# EAGLE design PGTN015_attenuverting_mixer (EAGLE 8.5.2)
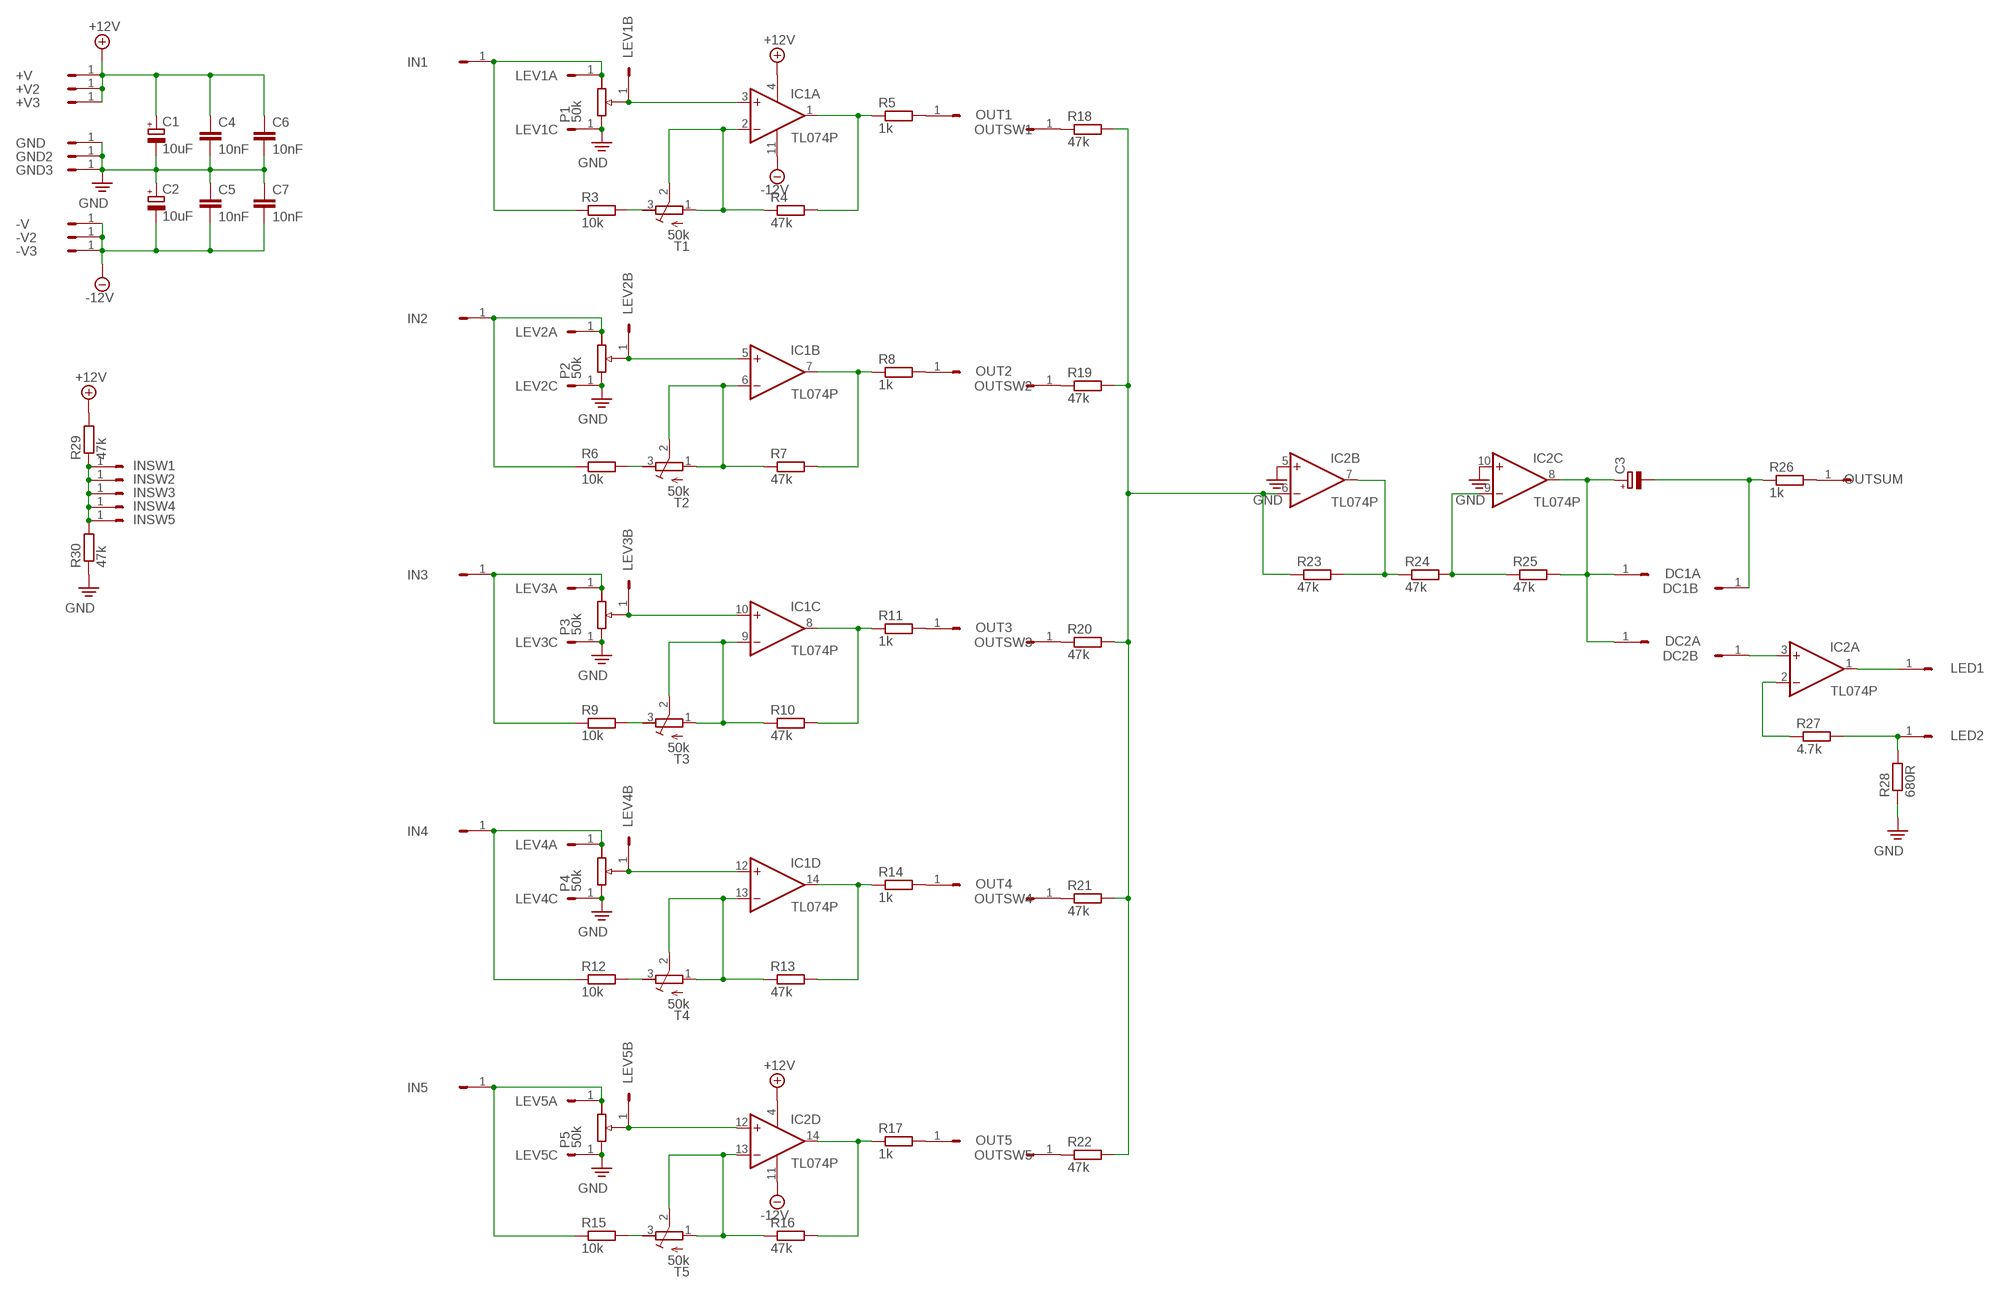
[diagram p0: schematic, sheet 1]

## Parts
+V  HEADER/MALE/01  [HEADER/MALE/01]
+V2  HEADER/MALE/01  [HEADER/MALE/01]
+V3  HEADER/MALE/01  [HEADER/MALE/01]
-V  HEADER/MALE/01  [HEADER/MALE/01]
-V2  HEADER/MALE/01  [HEADER/MALE/01]
-V3  HEADER/MALE/01  [HEADER/MALE/01]
C1  10uF  CAPACITOR/POLARIZEDE2.5-6  [E2,5-6]
C2  10uF  CAPACITOR/POLARIZEDE2.5-6  [E2,5-6]
C3  CAPACITOR/POLARIZEDE2.5-6  [E2,5-6]
C4  10nF  CAPACITORCERAMICDISC/5  [CERAMICDISC/5]
C5  10nF  CAPACITORCERAMICDISC/5  [CERAMICDISC/5]
C6  10nF  CAPACITORCERAMICDISC/5  [CERAMICDISC/5]
C7  10nF  CAPACITORCERAMICDISC/5  [CERAMICDISC/5]
DC1A  HEADER/MALE/01  [HEADER/MALE/01]
DC1B  HEADER/MALE/01  [HEADER/MALE/01]
DC2A  HEADER/MALE/01  [HEADER/MALE/01]
DC2B  HEADER/MALE/01  [HEADER/MALE/01]
GND  HEADER/MALE/01  [HEADER/MALE/01]
GND2  HEADER/MALE/01  [HEADER/MALE/01]
GND3  HEADER/MALE/01  [HEADER/MALE/01]
IC1  TL074P  [DIL14]
IC2  TL074P  [DIL14]
IN1  HEADER/MALE/01  [HEADER/MALE/01]
IN2  HEADER/MALE/01  [HEADER/MALE/01]
IN3  HEADER/MALE/01  [HEADER/MALE/01]
IN4  HEADER/MALE/01  [HEADER/MALE/01]
IN5  HEADER/MALE/01  [HEADER/MALE/01]
INSW1  HEADER/MALE/01  [HEADER/MALE/01]
INSW2  HEADER/MALE/01  [HEADER/MALE/01]
INSW3  HEADER/MALE/01  [HEADER/MALE/01]
INSW4  HEADER/MALE/01  [HEADER/MALE/01]
INSW5  HEADER/MALE/01  [HEADER/MALE/01]
LED1  HEADER/MALE/01  [HEADER/MALE/01]
LED2  HEADER/MALE/01  [HEADER/MALE/01]
LEV1A  HEADER/MALE/01  [HEADER/MALE/01]
LEV1B  HEADER/MALE/01  [HEADER/MALE/01]
LEV1C  HEADER/MALE/01  [HEADER/MALE/01]
LEV2A  HEADER/MALE/01  [HEADER/MALE/01]
LEV2B  HEADER/MALE/01  [HEADER/MALE/01]
LEV2C  HEADER/MALE/01  [HEADER/MALE/01]
LEV3A  HEADER/MALE/01  [HEADER/MALE/01]
LEV3B  HEADER/MALE/01  [HEADER/MALE/01]
LEV3C  HEADER/MALE/01  [HEADER/MALE/01]
LEV4A  HEADER/MALE/01  [HEADER/MALE/01]
LEV4B  HEADER/MALE/01  [HEADER/MALE/01]
LEV4C  HEADER/MALE/01  [HEADER/MALE/01]
LEV5A  HEADER/MALE/01  [HEADER/MALE/01]
LEV5B  HEADER/MALE/01  [HEADER/MALE/01]
LEV5C  HEADER/MALE/01  [HEADER/MALE/01]
OUT1  HEADER/MALE/01  [HEADER/MALE/01]
OUT2  HEADER/MALE/01  [HEADER/MALE/01]
OUT3  HEADER/MALE/01  [HEADER/MALE/01]
OUT4  HEADER/MALE/01  [HEADER/MALE/01]
OUT5  HEADER/MALE/01  [HEADER/MALE/01]
OUTSUM  HEADER/MALE/01  [HEADER/MALE/01]
OUTSW1  HEADER/MALE/01  [HEADER/MALE/01]
OUTSW2  HEADER/MALE/01  [HEADER/MALE/01]
OUTSW3  HEADER/MALE/01  [HEADER/MALE/01]
OUTSW4  HEADER/MALE/01  [HEADER/MALE/01]
OUTSW5  HEADER/MALE/01  [HEADER/MALE/01]
P1  50k  POTENTIOMETER  (no package)
P2  50k  POTENTIOMETER  (no package)
P3  50k  POTENTIOMETER  (no package)
P4  50k  POTENTIOMETER  (no package)
P5  50k  POTENTIOMETER  (no package)
R3  10k  RESISTORRESISTOR/UPRIGHT/7.5  [RESISTOR/7.5]
R4  47k  RESISTORRESISTOR/UPRIGHT/7.5  [RESISTOR/7.5]
R5  1k  RESISTORRESISTOR/UPRIGHT/7.5  [RESISTOR/7.5]
R6  10k  RESISTORRESISTOR/UPRIGHT/7.5  [RESISTOR/7.5]
R7  47k  RESISTORRESISTOR/UPRIGHT/7.5  [RESISTOR/7.5]
R8  1k  RESISTORRESISTOR/UPRIGHT/7.5  [RESISTOR/7.5]
R9  10k  RESISTORRESISTOR/UPRIGHT/7.5  [RESISTOR/7.5]
R10  47k  RESISTORRESISTOR/UPRIGHT/7.5  [RESISTOR/7.5]
R11  1k  RESISTORRESISTOR/UPRIGHT/7.5  [RESISTOR/7.5]
R12  10k  RESISTORRESISTOR/UPRIGHT/7.5  [RESISTOR/7.5]
R13  47k  RESISTORRESISTOR/UPRIGHT/7.5  [RESISTOR/7.5]
R14  1k  RESISTORRESISTOR/UPRIGHT/7.5  [RESISTOR/7.5]
R15  10k  RESISTORRESISTOR/UPRIGHT/7.5  [RESISTOR/7.5]
R16  47k  RESISTORRESISTOR/UPRIGHT/7.5  [RESISTOR/7.5]
R17  1k  RESISTORRESISTOR/UPRIGHT/7.5  [RESISTOR/7.5]
R18  47k  RESISTORRESISTOR/UPRIGHT/7.5  [RESISTOR/7.5]
R19  47k  RESISTORRESISTOR/UPRIGHT/7.5  [RESISTOR/7.5]
R20  47k  RESISTORRESISTOR/UPRIGHT/7.5  [RESISTOR/7.5]
R21  47k  RESISTORRESISTOR/UPRIGHT/7.5  [RESISTOR/7.5]
R22  47k  RESISTORRESISTOR/UPRIGHT/7.5  [RESISTOR/7.5]
R23  47k  RESISTORRESISTOR/UPRIGHT/7.5  [RESISTOR/7.5]
R24  47k  RESISTORRESISTOR/UPRIGHT/7.5  [RESISTOR/7.5]
R25  47k  RESISTORRESISTOR/UPRIGHT/7.5  [RESISTOR/7.5]
R26  1k  RESISTORRESISTOR/UPRIGHT/7.5  [RESISTOR/7.5]
R27  4.7k  RESISTORRESISTOR/UPRIGHT/7.5  [RESISTOR/7.5]
R28  680R  RESISTORRESISTOR/UPRIGHT/7.5  [RESISTOR/7.5]
R29  47k  RESISTORRESISTOR/UPRIGHT/7.5  [RESISTOR/7.5]
R30  47k  RESISTORRESISTOR/UPRIGHT/7.5  [RESISTOR/7.5]
T1  50k  TRIMMER64X  [TRIMMER/64B]
T2  50k  TRIMMER64X  [TRIMMER/64B]
T3  50k  TRIMMER64X  [TRIMMER/64B]
T4  50k  TRIMMER64X  [TRIMMER/64B]
T5  50k  TRIMMER64X  [TRIMMER/64B]

## Nets
+12V: +V2.1 +V3.1 +V.1 C1.+ C4.1 C6.1 IC1.4(P:V+) IC2.4(P:V+) R29.2
-12V: -V2.1 -V3.1 -V.1 C2.- C5.2 C7.2 IC1.11(P:V-) IC2.11(P:V-)
GND: C1.- C2.+ C4.2 C5.1 C6.2 C7.1 GND2.1 GND3.1 GND.1 IC2.5(B:+IN) IC2.10(C:+IN) LEV1C.1 LEV2C.1 LEV3C.1 LEV4C.1 LEV5C.1 P1.E P2.E P3.E P4.E P5.E R28.1 R30.1
N$1: IC1.2(A:-IN) R4.1 T1.1(E) T1.2(S)
N$2: IC1.3(A:+IN) LEV1B.1 P1.S
N$3: R3.2 T1.3(A)
N$4: IC1.1(A:OUT) R4.2 R5.1
N$5: IN1.1 LEV1A.1 P1.A R3.1
N$6: OUT1.1 R5.2
N$7: IC1.6(B:-IN) R7.1 T2.1(E) T2.2(S)
N$8: R6.2 T2.3(A)
N$9: IC1.7(B:OUT) R7.2 R8.1
N$10: IC1.5(B:+IN) LEV2B.1 P2.S
N$11: IN2.1 LEV2A.1 P2.A R6.1
N$12: OUT2.1 R8.2
N$13: IC1.9(C:-IN) R10.1 T3.1(E) T3.2(S)
N$14: R9.2 T3.3(A)
N$15: IC1.8(C:OUT) R10.2 R11.1
N$16: IC1.10(C:+IN) LEV3B.1 P3.S
N$17: IN3.1 LEV3A.1 P3.A R9.1
N$18: OUT3.1 R11.2
N$19: IC1.13(D:-IN) R13.1 T4.1(E) T4.2(S)
N$20: R12.2 T4.3(A)
N$21: IC1.14(D:OUT) R13.2 R14.1
N$22: IC1.12(D:+IN) LEV4B.1 P4.S
N$23: IN4.1 LEV4A.1 P4.A R12.1
N$24: OUT4.1 R14.2
N$25: IC2.13(D:-IN) R16.1 T5.1(E) T5.2(S)
N$26: R15.2 T5.3(A)
N$27: IC2.14(D:OUT) R16.2 R17.1
N$28: IC2.12(D:+IN) LEV5B.1 P5.S
N$29: IN5.1 LEV5A.1 P5.A R15.1
N$30: OUT5.1 R17.2
N$31: OUTSW1.1 R18.1
N$32: OUTSW2.1 R19.1
N$33: OUTSW3.1 R20.1
N$34: OUTSW4.1 R21.1
N$35: OUTSW5.1 R22.1
N$36: C3.- DC1B.1 R26.1
N$37: IC2.7(B:OUT) R23.2 R24.1
N$38: IC2.6(B:-IN) R18.2 R19.2 R20.2 R21.2 R22.2 R23.1
N$39: IC2.9(C:-IN) R24.2 R25.1
N$40: C3.+ DC1A.1 DC2A.1 IC2.8(C:OUT) R25.2
N$41: OUTSUM.1 R26.2
N$42: DC2B.1 IC2.3(A:+IN)
N$43: IC2.2(A:-IN) R27.1
N$44: LED2.1 R27.2 R28.2
N$45: IC2.1(A:OUT) LED1.1
N$46: INSW1.1 INSW2.1 INSW3.1 INSW4.1 INSW5.1 R29.1 R30.2

## Library data of the parts
+V +V2 +V3 -V -V2 -V3 DC1A DC1B DC2A DC2B GND GND2 GND3 IN1-IN5 INSW1-INSW5 LED1 LED2 LEV1A LEV1B LEV1C LEV2A LEV2B LEV2C LEV3A LEV3B LEV3C LEV4A LEV4B LEV4C LEV5A LEV5B LEV5C OUT1-OUT5 OUTSUM OUTSW1-OUTSW5 = connectors:HEADER/MALE/01; SPICEPREFIX: X
C1 C2 = capacitors:CAPACITOR/POLARIZED: POLARIZED CAPACITOR, European symbol; SPICEPREFIX: C
C3 = capacitors:CAPACITOR/POLARIZED: POLARIZED CAPACITOR, European symbol
C4-C7 = capacitors:CAPACITOR: CAPACITOR, European symbol
IC1 IC2 = ic_analogue:TL074: OP AMP
P1-P5 = controls_off_brd:POTENTIOMETER: Trimm resistor; _EXTERNAL_: 1
R3-R30 = resistors:RESISTOR: RESISTOR, European symbol
T1-T5 = resistors:TRIMMER: Trimm resistor

## Board
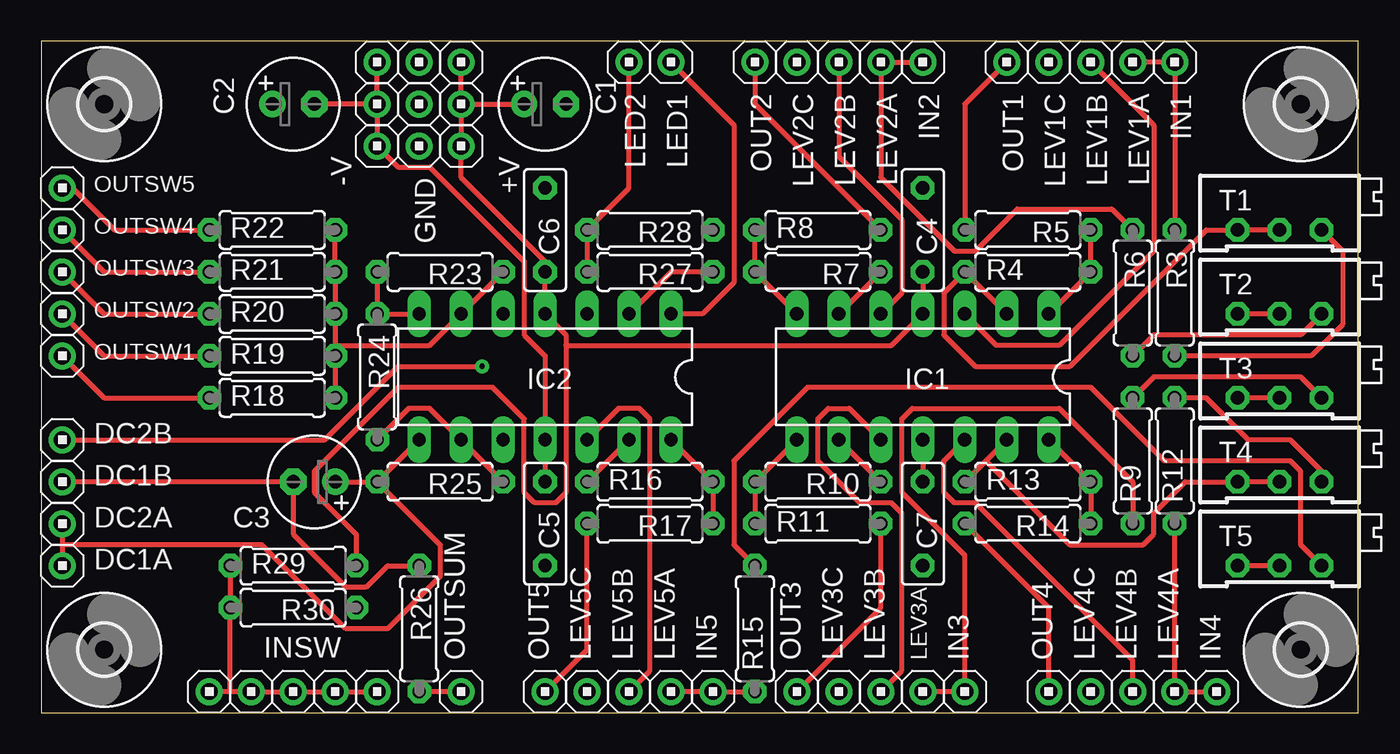
[diagram p1: board, top side]
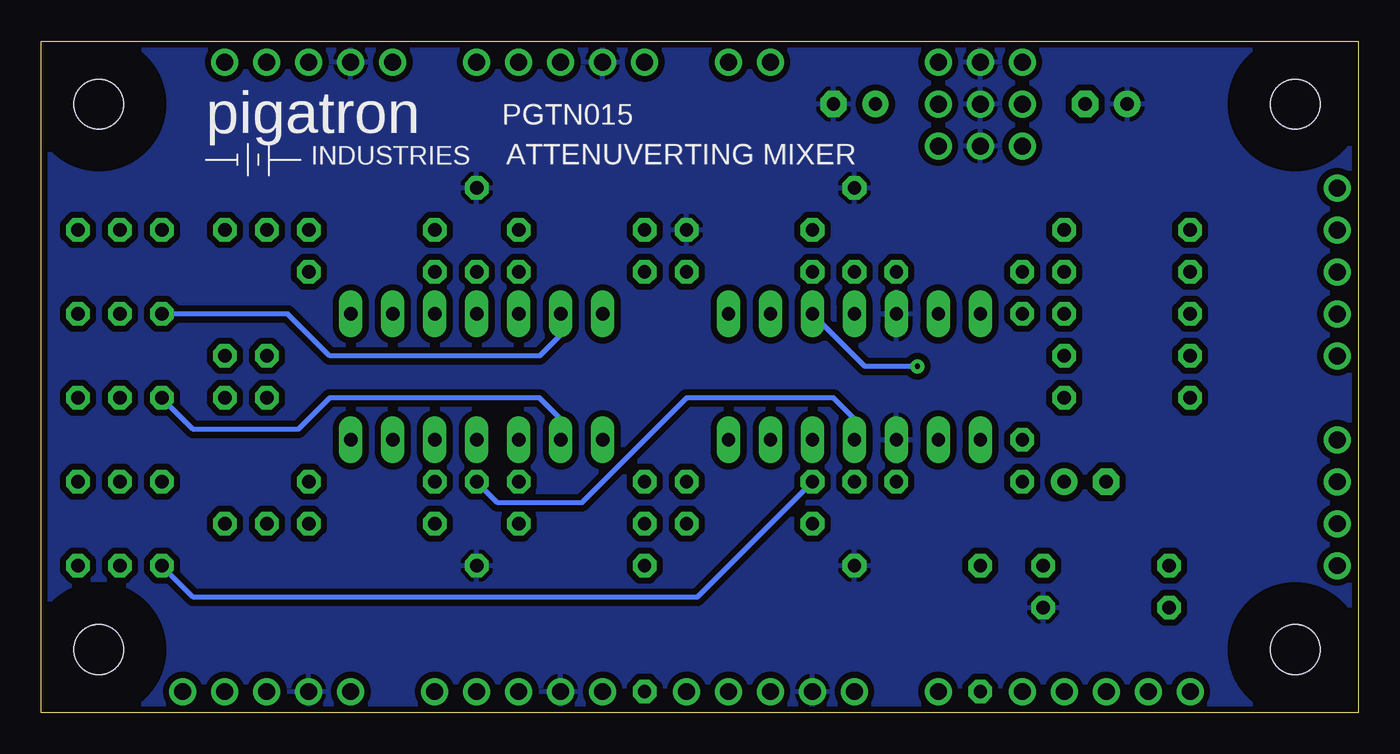
[diagram p2: board, bottom side, seen from below]

Size 79.68 x 40.63 mm. Coordinates in mm from the lower left corner, seen from the top.
Outline: 0,0 79.68,0 79.68,40.63 0,40.63 0,0
Copper layers (1*16): Top 0.0356mm / dielectric 1.5011mm / Bottom 0.0356mm
Design rules "pigatron": minimum track width 12mil, minimum drill 13mil, track to track 15mil, track to pad 10mil, pad to pad 10mil, via to via 10mil, smd to smd 6mil, copper to edge 15mil, drill to drill 10mil, minimum pad ring 12mil, minimum via ring 10mil, stop-mask expansion 4mil, vias tented up to drill 0mil, thermal gap 10mil

### Footprints (pad centres in the part's own frame; a part is rotated, then mirrored left to right if it is on the bottom)
HEADER/MALE/01 = drill 1.016: 1 0,0
E2,5-6 = drill 0.813 pad 1.6: + -1.27,0 | drill 0.813 pad 1.6 octagon: - 1.27,0
CERAMICDISC/5 = drill 0.813 octagon: 1 -2.54,0; 2 2.54,0
DIL14 = drill 0.813 long: 1 -7.62,-3.81; 2 -5.08,-3.81; 3 -2.54,-3.81; 4 0,-3.81; 5 2.54,-3.81; 6 5.08,-3.81; 7 7.62,-3.81; 8 7.62,3.81; 9 5.08,3.81; 10 2.54,3.81; 11 0,3.81; 12 -2.54,3.81; 13 -5.08,3.81; 14 -7.62,3.81
RESISTOR/7.5 = drill 0.813 octagon: 1 -3.81,0; 2 3.81,0
TRIMMER/64B = drill 0.813 octagon: 1 1.27,-2.54; 2 1.27,0; 3 1.27,2.54
STANDOFF/3.0 = hole 3: 0,0

### Placement (x,y rotation side)
+V  25.4,34.29 270 top
+V2  25.4,36.83 270 top
+V3  25.4,39.37 270 top
-V  20.32,34.29 270 top
-V2  20.32,36.83 270 top
-V3  20.32,39.37 270 top
C1  30.48,36.83 0 top
C2  15.24,36.83 0 top
C3  16.51,13.97 180 top
C4  53.34,29.21 90 top
C5  30.48,11.43 90 top
C6  30.48,29.21 90 top
C7  53.34,11.43 90 top
DC1A  1.27,8.89 0 top
DC1B  1.27,13.97 0 top
DC2A  1.27,11.43 0 top
DC2B  1.27,16.51 0 top
GND  22.86,34.29 270 top
GND2  22.86,39.37 270 top
GND3  22.86,36.83 270 top
IC1  53.34,20.32 180 top
IC2  30.48,20.32 180 top
IN1  68.58,39.37 270 top
IN2  53.34,39.37 270 top
IN3  55.88,1.27 90 top
IN4  71.12,1.27 90 top
IN5  40.64,1.27 90 top
INSW1  15.24,1.27 0 top
INSW2  12.7,1.27 0 top
INSW3  10.16,1.27 0 top
INSW4  17.78,1.27 0 top
INSW5  20.32,1.27 0 top
LED1  38.1,39.37 270 top
LED2  35.56,39.37 270 top
LEV1A  66.04,39.37 270 top
LEV1B  63.5,39.37 270 top
LEV1C  60.96,39.37 270 top
LEV2A  50.8,39.37 270 top
LEV2B  48.26,39.37 270 top
LEV2C  45.72,39.37 270 top
LEV3A  53.34,1.27 90 top
LEV3B  50.8,1.27 90 top
LEV3C  48.26,1.27 90 top
LEV4A  68.58,1.27 90 top
LEV4B  66.04,1.27 90 top
LEV4C  63.5,1.27 90 top
LEV5A  38.1,1.27 90 top
LEV5B  35.56,1.27 90 top
LEV5C  33.02,1.27 90 top
OUT1  58.42,39.37 270 top
OUT2  43.18,39.37 270 top
OUT3  45.72,1.27 90 top
OUT4  60.96,1.27 90 top
OUT5  30.48,1.27 90 top
OUTSUM  25.4,1.27 90 top
OUTSW1  1.27,21.59 0 top
OUTSW2  1.27,24.13 0 top
OUTSW3  1.27,26.67 0 top
OUTSW4  1.27,29.21 0 top
OUTSW5  1.27,31.75 0 top
R3  68.58,25.4 270 top
R4  59.69,26.67 0 top
R5  59.69,29.21 180 top
R6  66.04,25.4 270 top
R7  46.99,26.67 180 top
R8  46.99,29.21 0 top
R9  66.04,15.24 90 top
R10  46.99,13.97 180 top
R11  46.99,11.43 0 top
R12  68.58,15.24 90 top
R13  59.69,13.97 0 top
R14  59.69,11.43 180 top
R15  43.18,5.08 90 top
R16  36.83,13.97 0 top
R17  36.83,11.43 180 top
R18  13.97,19.05 0 top
R19  13.97,21.59 0 top
R20  13.97,24.13 0 top
R21  13.97,26.67 0 top
R22  13.97,29.21 0 top
R23  24.13,26.67 180 top
R24  20.32,20.32 270 top
R25  24.13,13.97 180 top
R26  22.86,5.08 270 top
R27  36.83,26.67 180 top
R28  36.83,29.21 180 top
R29  15.24,8.89 0 top
R30  15.24,6.35 180 top
T1  74.93,30.48 270 top
T2  74.93,25.4 270 top
T3  74.93,20.32 270 top
T4  74.93,15.24 270 top
T5  74.93,10.16 270 top
U$1  [STANDOFF/3.0]  3.81,36.83 0 top
U$2  [STANDOFF/3.0]  76.2,36.83 0 top
U$3  [STANDOFF/3.0]  76.2,3.81 0 top
U$4  [STANDOFF/3.0]  3.81,3.81 0 top
U$5  [PIGATRON-LOGO]  60.83,35.05 0 bottom

### Tracks (layer width: path | path; a pad name or v marks a point on that pad's centre or on a via)
+12V
  Top 0.305: +V2.1 C1.+ | +V2.1 +V.1 25.4,32.39 30.48,27.3 C6.1 IC2.4 31.75,22.86 31.75,22.23 | +V2.1 +V3.1 | C4.1 IC1.4 51.44,22.23 31.75,22.23 | R29.2 19.05,10.79 16.51,13.33 16.51,14.6 21.59,19.69 27.3,19.69 29.21,17.78 29.21,13.33 29.84,12.7 31.12,12.7 31.75,13.33 31.75,22.23
-12V
  Top 0.305: C5.2 IC2.11 30.48,21.59 29.21,22.86 29.21,27.3 23.49,33.02 21.59,33.02 -V.1 -V2.1 | -V2.1 C2.- | -V2.1 -V3.1 | IC1.11 C7.2
  Bottom 0.305: C7.2 52.07,12.7 46.99,12.7 40.64,19.05 31.75,19.05 30.48,17.78 IC2.11
GND
  pour Bottom: 0,40.64 0,0 80.01,0 80.01,40.64
N$1
  Top 0.305: T1.2 T1.1 70.48,29.21 62.23,20.95 56.52,20.95 54.61,22.86 54.61,25.4 R4.1 IC1.2
N$2
  Top 0.305: IC1.3 57.79,22.23 61.59,22.23 67.31,27.94 67.31,35.56 LEV1B.1
N$3
  Top 0.305: R3.2 76.84,21.59 78.74,23.49 78.74,27.94 T1.3
N$4
  Top 0.305: IC1.1 R4.2 R5.1
N$5
  Top 0.305: R3.1 IN1.1 LEV1A.1
N$6
  Top 0.305: R5.2 55.88,36.83 OUT1.1
N$7
  Top 0.305: T2.2 T2.1 | R7.1 IC1.6
  Bottom 0.305: T2.1 64.77,24.13 62.23,21.59 49.53,21.59 48.26,22.86 IC1.6
N$8
  Top 0.305: R6.2 67.31,22.86 76.2,22.86 T2.3
N$9
  Top 0.305: IC1.7 R7.2 R8.1
N$10
  Top 0.305: IC1.5 52.07,25.4 52.07,29.84 48.26,33.66 LEV2B.1
N$11
  Top 0.305: R6.1 64.77,30.48 59.06,30.48 56.52,27.94 55.25,27.94 50.8,32.39 LEV2A.1 IN2.1
N$12
  Top 0.305: R8.2 43.18,36.83 OUT2.1
N$13
  Top 0.305: R10.1 IC1.9 | T3.2 T3.1
  Bottom 0.305: T3.1 70.48,17.15 64.14,17.15 62.23,19.05 49.53,19.05 48.26,17.78 IC1.9
N$14
  Top 0.305: R9.2 67.31,20.32 76.2,20.32 T3.3
N$15
  Top 0.305: R11.1 R10.2 IC1.8
N$16
  Top 0.305: IC1.10 48.9,18.41 47.62,18.41 46.99,17.78 46.99,15.24 49.53,12.7 51.44,12.7 52.07,12.06 52.07,2.54 LEV3B.1
N$17
  Top 0.305: R9.1 66.04,13.97 61.59,18.41 52.7,18.41 52.07,17.78 52.07,13.33 55.88,9.53 IN3.1 LEV3A.1
N$18
  Top 0.305: R11.2 50.8,6.35 OUT3.1
N$19
  Top 0.305: T4.2 T4.1 69.22,13.97 67.31,12.06 67.31,10.79 66.67,10.16 62.23,10.16 57.15,15.24 | IC1.13 57.15,15.24 | 57.15,15.24 R13.1
N$20
  Top 0.305: R12.2 70.48,19.05 73.03,16.51 75.56,16.51 77.47,14.6 T4.3
N$21
  Top 0.305: R14.1 R13.2 IC1.14
N$22
  Top 0.305: IC1.12 54.61,15.24 54.61,13.33 55.25,12.7 56.52,12.7 66.04,3.18 LEV4B.1
N$23
  Top 0.305: R12.1 LEV4A.1 IN4.1
N$24
  Top 0.305: R14.2 60.96,6.35 OUT4.1
N$25
  Top 0.305: T5.2 T5.1 | IC2.13 R16.1
  Bottom 0.305: T5.1 70.48,6.98 40.01,6.98 R16.1
N$26
  Top 0.305: R15.2 41.91,10.16 41.91,15.24 46.36,19.69 63.5,19.69 67.95,15.24 75.56,15.24 76.2,14.6 76.2,10.16 T5.3
N$27
  Top 0.305: R17.1 R16.2 IC2.14
N$28
  Top 0.305: IC2.12 34.93,18.41 36.2,18.41 36.83,17.78 36.83,2.54 LEV5B.1
N$29
  Top 0.305: R15.1 IN5.1 LEV5A.1
N$30
  Top 0.305: R17.2 33.02,3.81 OUT5.1
N$31
  Top 0.305: R18.1 3.81,19.05 OUTSW1.1
N$32
  Top 0.305: R19.1 3.81,21.59 OUTSW2.1
N$33
  Top 0.305: R20.1 3.81,24.13 OUTSW3.1
N$34
  Top 0.305: R21.1 3.81,26.67 OUTSW4.1
N$35
  Top 0.305: R22.1 4.45,29.21 1.91,31.75 OUTSW5.1
N$36
  Top 0.305: R26.1 20.95,8.89 19.69,7.62 18.41,7.62 15.24,10.79 C3.- DC1B.1
N$37
  Top 0.305: R23.2 R24.1 IC2.7
N$38
  Top 0.305: R23.1 IC2.6 23.49,22.23 17.78,22.23 | R18.2 R19.2 17.78,22.23 | R22.2 R21.2 R20.2 17.78,22.23
N$39
  Top 0.305: R24.2 22.23,18.41 23.49,18.41 IC2.9 R25.1
N$40
  Top 0.305: DC2A.1 1.27,10.16 | 1.27,10.16 DC1A.1 | C3.+ R25.2 | R25.2 IC2.8 | 1.27,10.16 13.33,10.16 18.41,5.08 20.95,5.08 24.13,8.26 24.13,10.16 R25.2
N$41
  Top 0.305: OUTSUM.1 R26.2
N$42  (via drill 0.33)
  Top 0.305: v26.67,20.95 21.59,20.95 17.15,16.51 DC2B.1
  Bottom 0.305: IC2.3 29.84,20.95 v26.67,20.95
N$43
  Top 0.305: IC2.2 38.1,26.67 R27.1
N$44
  Top 0.305: R27.2 R28.2 35.56,31.75 LED2.1
N$45
  Top 0.305: IC2.1 40.01,24.13 41.91,26.03 41.91,35.56 LED1.1
N$46
  Top 0.305: R29.1 R30.2 11.43,1.27 | 11.43,1.27 INSW2.1 INSW1.1 INSW4.1 INSW5.1 | 11.43,1.27 INSW3.1

### Text on the board
tNames: INSW
bNames: PGTN015 | ATTENUVERTING MIXER